# Altium project LEDDimmer.PrjPcb
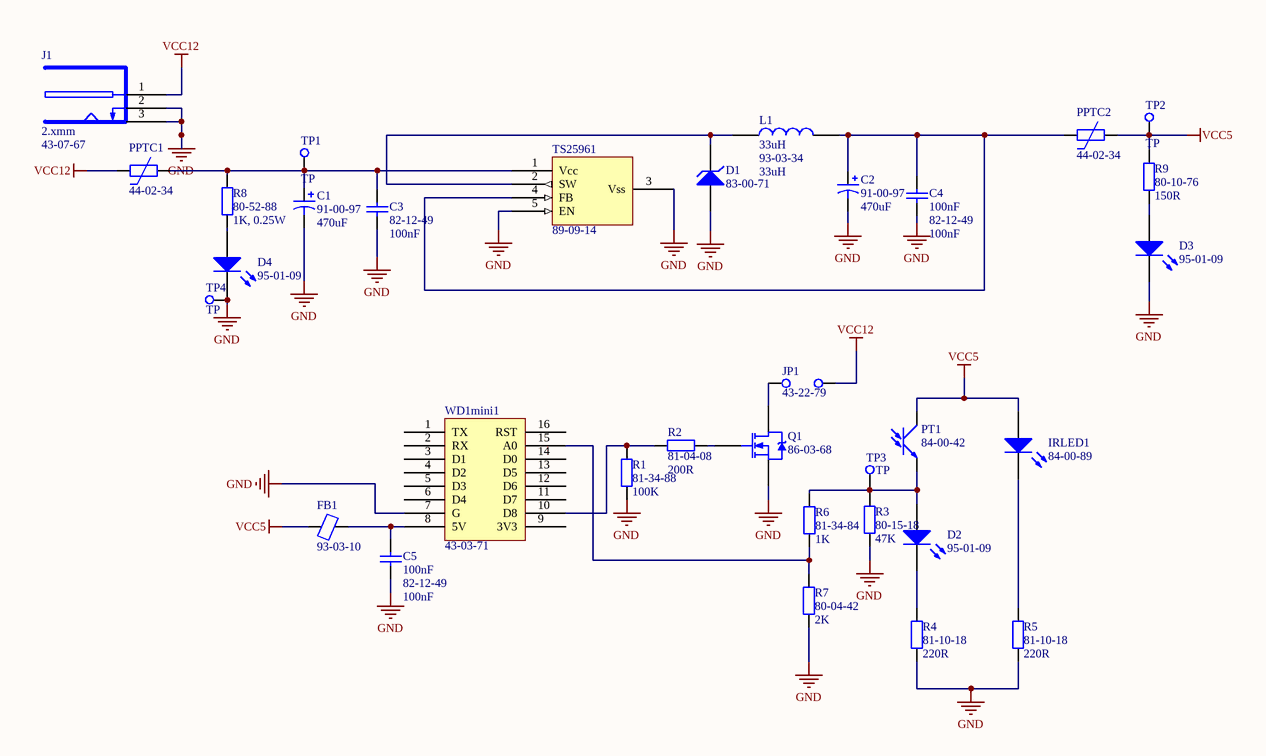
[diagram p0: LEDDimmer.SchDoc]
1 sheet, 33 parts. Net scope: global (net labels, ports and power ports of the same name join across sheets).
Board file: LEDDimmer.PcbDoc

## Sheet LEDDimmer.SchDoc
size A4

### Parts
C1  Supplier: 91-00-97  [ELKO_CAP]  (hidden comment: 470uF)
C2  Supplier: 91-00-97  [ELKO_CAP]  (hidden comment: 470uF)
C3  Supplier: 82-12-49  [FP_0402_CAP_050]  (hidden comment: 100nF)
C4  100nF  Supplier: 82-12-49  [FP_0402_CAP_050]
C5  100nF  Supplier: 82-12-49  [FP_0402_CAP_050]
D1  Supplier: 83-00-71  [SCHOTTKY]  (hidden comment: ZENER)
D2  Supplier: 95-01-09  [FP_0805_LED_GREEN]  (hidden comment: LED)
D3  Supplier: 95-01-09  [FP_0805_LED_RED]  (hidden comment: LED)
D4  Supplier: 95-01-09  [FP_0805_LED_RED]  (hidden comment: LED)
FB1  Supplier: 93-03-10  [FB]  (hidden comment: FB)
IRLED1  Supplier: 84-00-89  [IRLED]  (hidden comment: IRLED)
J1  2.xmm  Supplier: 43-07-67  [FP_DC_TAP_ANYA]
JP1  Supplier: 43-22-79  [CONN2]  (hidden comment: JUMPER)
L1  33uH  Supplier: 93-03-34  [IND]
PPTC1  Supplier: 44-02-34  [PPTC]  (hidden comment: PPTC)
PPTC2  Supplier: 44-02-34  [PPTC]  (hidden comment: PPTC)
PT1  Supplier: 84-00-42  [IRLED]  (hidden comment: PT)
Q1  Supplier: 86-03-68  [IRL540N]  (hidden comment: NMOS)
R1  Supplier: 81-34-88  [FP_0603_RES]  (hidden comment: 100K)
R2  value 200R  Supplier: 81-04-08  [FP_0603_RES]  (hidden comment: 200)
R3  Supplier: 80-15-18  [FP_0603_RES]  (hidden comment: 47K)
R4  value 220R  Supplier: 81-10-18  [FP_0603_RES]  (hidden comment: 220)
R5  value 220R  Supplier: 81-10-18  [FP_0603_RES]  (hidden comment: 220)
R6  Supplier: 81-34-84  [FP_0603_RES]  (hidden comment: 1K)
R7  Supplier: 80-04-42  [FP_0603_RES]  (hidden comment: 2K)
R8  Supplier: 80-52-88  [FP_1206_RES]  (hidden comment: 1K, 0.25W)
R9  Supplier: 80-10-76  [FP_0805_RES]  (hidden comment: 150R)
TP1  TP  [FP_CONN1_TUSKE_254MM]
TP2  TP  [FP_CONN1_TUSKE_254MM]
TP3  TP  [FP_CONN1_TUSKE_254MM]
TP4  TP  [FP_CONN1_TUSKE_254MM]
TS25961  Supplier: 89-09-14  [TS2596]  (hidden comment: *)
WD1mini1  Supplier: 43-03-71  [WEMOSD1]  (hidden comment: WD1mini)

### Nets
GND: C1.N C2.N C3.1 C4.1 C5.1 D1.1(A) D3.2(K) D4.2(K) J1.2(GND) J1.3(GND) Q1.3(S) R1.1 R3.1 R4.1 R5.1 R7.1 TP4.1(C1) TS25961.3(Vss) TS25961.5(EN) WD1mini1.7(G)
VCC5: FB1.1 IRLED1.1(A) PPTC2.2 PT1.1(A) R9.2 TP2.1(C1)
VCC12: J1.1(9V) JP1.1(C1) PPTC1.1
NetC1_P: C1.P C3.2 PPTC1.2 R8.2 TP1.1(C1) TS25961.1(Vcc)
NetC2_P: C2.P C4.2 L1.2 PPTC2.1 TS25961.4(FB)
NetC5_2: C5.2 FB1.2 WD1mini1.8(5V)
NetD1_2: D1.2(K) L1.1 TS25961.2(SW)
NetD2_1: D2.1(A) PT1.2(K) R3.2 R6.2 TP3.1(C1)
NetD2_2: D2.2(K) R4.2
NetD3_1: D3.1(A) R9.1
NetD4_1: D4.1(A) R8.1
NetIRLED1_2: IRLED1.2(K) R5.2
NetJP1_2: JP1.2(C2) Q1.2(D)
NetQ1_1: Q1.1(G) R2.2
NetR1_2: R1.2 R2.1 WD1mini1.10(D8)
NetR6_1: R6.1 R7.2 WD1mini1.15(A0)

Not connected (* = marked no-connect by the designer): WD1mini1 1(TX) 2(RX) 3(D1) 4(D2) 5(D3) 6(D4) 9(3V3) 11(D7) 12(D6) 13(D5) 14(D0) 16(RST)

### Library data of the parts
C1 C2 = CAP_ELECT: Polarized Capacitor; ComponentLink1URL: https://lomex.hu/pdf/(tea)_xv_series.pdf; ComponentLink2URL: https://lomex.hu/hu/webshop/#/search,91-00-97/stype,1; ComponentLink1Description: Datasheet; ComponentLink2Description: Store; Value: 470uF
C3-C5 = CAP_100n: Capacitor; ComponentLink1Description: Datasheet; ComponentLink2Description: Store; ComponentLink1URL: https://lomex.hu/pdf/(sam)_cl05b104ko5nnnd.pdf; ComponentLink2URL: https://lomex.hu/hu/webshop/#/search,82-12-49/stype,1; Value: 100nF
D1 = ZENER: Zener Diode; U_Z: 24; ComponentLink1URL: https://lomex.hu/pdf/(tsc)_sk32a-sk315a.pdf; ComponentLink2URL: https://lomex.hu/hu/webshop/#page,0/search,83-00-71/stype,1; ComponentLink1Description: Datasheet; ComponentLink2Description: Store
D2-D4 = LED: Typical RED GaAs LED; pin to pad: 1>A 2>K; ComponentLink1Description: Datasheet; ComponentLink2Description: Store; ComponentLink1URL: https://lomex.hu/pdf/(kin)_kp-2012sgc.pdf; ComponentLink2URL: https://lomex.hu/hu/webshop/#page,0/search,95-01-09/stype,1
FB1 = FB: Ferrite bead; ComponentLink1URL: https://lomex.hu/pdf/(vik)_cb.pdf; ComponentLink2URL: https://lomex.hu/hu/webshop/#/search,93-03-10/stype,1; ComponentLink1Description: Datasheet; ComponentLink2Description: Store
IRLED1 = IRLED: InfraLED; ComponentLink1Description: Datasheet; ComponentLink2Description: Store; ComponentLink1URL: https://lomex.hu/pdf/(kin)_kp-2012f3c.pdf; ComponentLink2URL: https://lomex.hu/hu/webshop/#page,0/search,84-00-89/stype,1
J1 = DC_TAP_ANYA: 2.xmm DC HEBA25 TÁPFESZÜLTSÉG ALJZAT ZÁRT, NYÁKBA 90°; ComponentLink2URL: https://lomex.hu/hu/webshop/#/search,43-07-67/stype,1; ComponentLink1URL: https://lomex.hu/pdf/g-s/(g-s)_dcs-5521-5.pdf; ComponentLink1Description: Datasheet; ComponentLink2Description: Store
JP1 = JUMPER: Jumper Wire; ComponentLink2URL: https://lomex.hu/hu/webshop/#page,0/search,43-22-79/stype,1; ComponentLink1URL: https://lomex.hu/pdf/(tlm)_tlphc-300r-1112-xxp-x.pdf; ComponentLink1Description: Datasheet; ComponentLink2Description: Store
L1 = IND: Inductor; ComponentLink1URL: https://lomex.hu/pdf/(vik)_pcdr.pdf; ComponentLink2URL: https://lomex.hu/hu/webshop/#page,0/search,93-03-34/stype,1; ComponentLink1Description: Datasheet; ComponentLink2Description: Store; Value: 33uH
PPTC1 PPTC2 = PPTC: Polymeric Positive Temperature Coefficient; ComponentLink1Description: Datasheet; ComponentLink2Description: Store; ComponentLink1URL: https://lomex.hu/pdf/(lfs)_1812l.pdf; ComponentLink2URL: https://lomex.hu/hu/webshop/#page,0/search,44-02-34/stype,1
PT1 = PTRANS: Phototransistor; ComponentLink2Description: Store; ComponentLink2URL: https://lomex.hu/hu/webshop/#page,0/search,84-00-42/stype,1; ComponentLink1Description: Datasheet; ComponentLink1URL: https://lomex.hu/pdf/k2012p3b.pdf
Q1 = NMOS: NXP - BSP030,115 - MOSFET, N CH, 30V, 10A, SOT223; ComponentLink2URL: https://lomex.hu/hu/webshop/#page,0/search,86-03-68/stype,1; ComponentLink1URL: https://lomex.hu/pdf/irl540ns.pdf; ComponentLink1Description: Datasheet; ComponentLink2Description: Store
R1 = RES_100K: Resistor; ComponentLink1URL: https://lomex.hu/pdf/(yag)_rc0603_serie.pdf; ComponentLink2Description: Store; ComponentLink2URL: https://lomex.hu/hu/webshop/#page,0/search,81-34-88/stype,1; ComponentLink1Description: Datasheet; Value: 100K
R2 = RES_200R: Resistor; ComponentLink1URL: https://lomex.hu/pdf/(koa)_rk73b.pdf; ComponentLink2Description: Store; ComponentLink2URL: https://lomex.hu/hu/webshop/#page,0/search,81-04-08/stype,1; ComponentLink1Description: Datasheet
R3 = RES_47K: Resistor; ComponentLink1URL: https://lomex.hu/pdf/(asj)_generalthickfilmchipresistor_09102017.pdf; ComponentLink2Description: Store; ComponentLink2URL: https://lomex.hu/hu/webshop/#page,0/search,80-15-18/stype,1; ComponentLink1Description: Datasheet; Value: 47K
R4 R5 = RES_220R: Resistor; ComponentLink1URL: https://lomex.hu/pdf/(tcl)_cr03.pdf; ComponentLink2Description: Store; ComponentLink2URL: https://lomex.hu/hu/webshop/#page,0/search,81-10-18/stype,1; ComponentLink1Description: Datasheet
R6 = RES_1K: Resistor; ComponentLink1URL: https://lomex.hu/pdf/(yag)_rc0603_serie.pdf; ComponentLink2Description: Store; ComponentLink2URL: https://lomex.hu/hu/webshop/#page,0/search,81-34-84/stype,1; ComponentLink1Description: Datasheet; Value: 1K
R7 = RES_2K: Resistor; ComponentLink1URL: https://lomex.hu/pdf/(yag)_rc0603_serie.pdf; ComponentLink2Description: Store; ComponentLink2URL: https://lomex.hu/hu/webshop/#page,0/search,80-04-42/stype,1; ComponentLink1Description: Datasheet; Value: 2K
R8 = RES_1K_025W: Resistor; ComponentLink1URL: https://lomex.hu/pdf/(yag)_rc1206_serie.pdf; ComponentLink2Description: Store; ComponentLink2URL: https://lomex.hu/hu/webshop/#/search,80-52-88/stype,1; ComponentLink1Description: Datasheet; Value: 1K, 0.25W
R9 = RES_150R: Resistor; ComponentLink1URL: https://lomex.hu/pdf/(tcl)_cr.pdf; ComponentLink2Description: Store; ComponentLink2URL: https://lomex.hu/hu/webshop/#/search,80-10-76/stype,1; ComponentLink1Description: Datasheet; Value: 150R
TP1-TP4 = TP: Test Point
TS25961 = TS2596: TS2596 Buck DCDC; ComponentLink1Description: Datasheet; ComponentLink2Description: Store; ComponentLink1URL: https://lomex.hu/pdf/tsc/(tsc)_ts2596.pdf; ComponentLink2URL: https://lomex.hu/hu/webshop/#page,0/search,89-09-14/stype,1
WD1mini1 = WEMOS: Wemos D1 mini; ComponentLink2URL: https://lomex.hu/hu/webshop/#page,0/search,43-03-71/stype,1; ComponentLink1URL: https://lomex.hu/pdf/(t-t)_fhsh-2.54-xx.pdf; ComponentLink2Description: Store; ComponentLink1Description: Datasheet